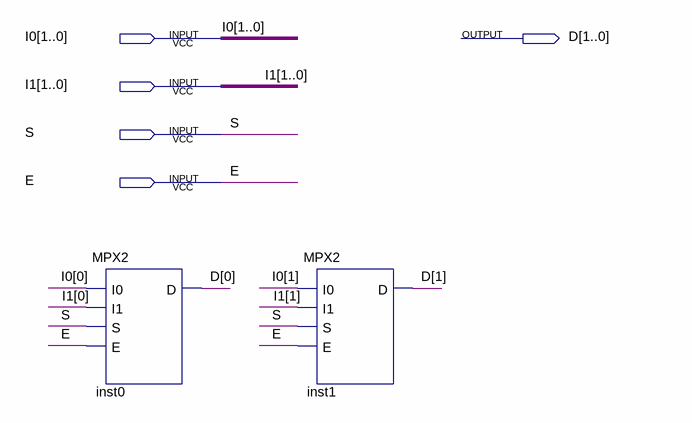
[diagram p0: schematic sheet]
// Quartus schematic MPX2_2BIT.bdf as structural Verilog: 2 symbols, 5 pins
module MPX2_2BIT (
  input  [1:0] I0,
  input  [1:0] I1,
  input  S,
  input  E,
  output [1:0] D
);

  MPX2 inst0 (.I0(I0[0]), .I1(I1[0]), .S(S), .E(E), .D(D[0]));
  MPX2 inst1 (.I0(I0[1]), .I1(I1[1]), .S(S), .E(E), .D(D[1]));
endmodule
